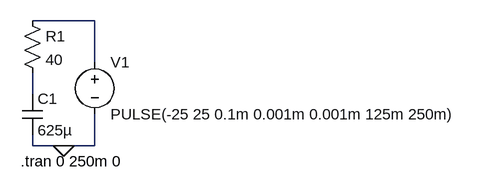
[diagram p0: schematic 2.asc]
2.asc, the LTspice schematic file:
Version 4
SHEET 1 880 680
WIRE 64 -112 -32 -112
WIRE 64 -48 64 -112
WIRE -32 0 -32 -32
WIRE -32 80 -32 64
WIRE 16 80 -32 80
WIRE 64 80 64 32
WIRE 64 80 16 80
FLAG 16 80 0
SYMBOL res -48 -128 R0
SYMATTR InstName R1
SYMATTR Value 40
SYMBOL cap -48 0 R0
SYMATTR InstName C1
SYMATTR Value 625µ
SYMBOL voltage 64 -64 R0
WINDOW 123 0 0 Left 0
WINDOW 39 0 0 Left 0
SYMATTR InstName V1
SYMATTR Value PULSE(-25 25 0.1m 0.001m 0.001m 125m 250m)
TEXT -50 104 Left 2 !.tran 0 250m 0

The netlist it stands for:
* 2.asc
R1 N001 N002 40
C1 N002 0 625µ
V1 N001 0 PULSE(-25 25 0.1m 0.001m 0.001m 125m 250m)
.tran 0 250m 0
.backanno
.end